# Altium schematic sheet tesis_page4_adc.SchDoc: ADC
size A4; Date: 01/04/2021; SheetNumber: 4; SheetTotal: 5
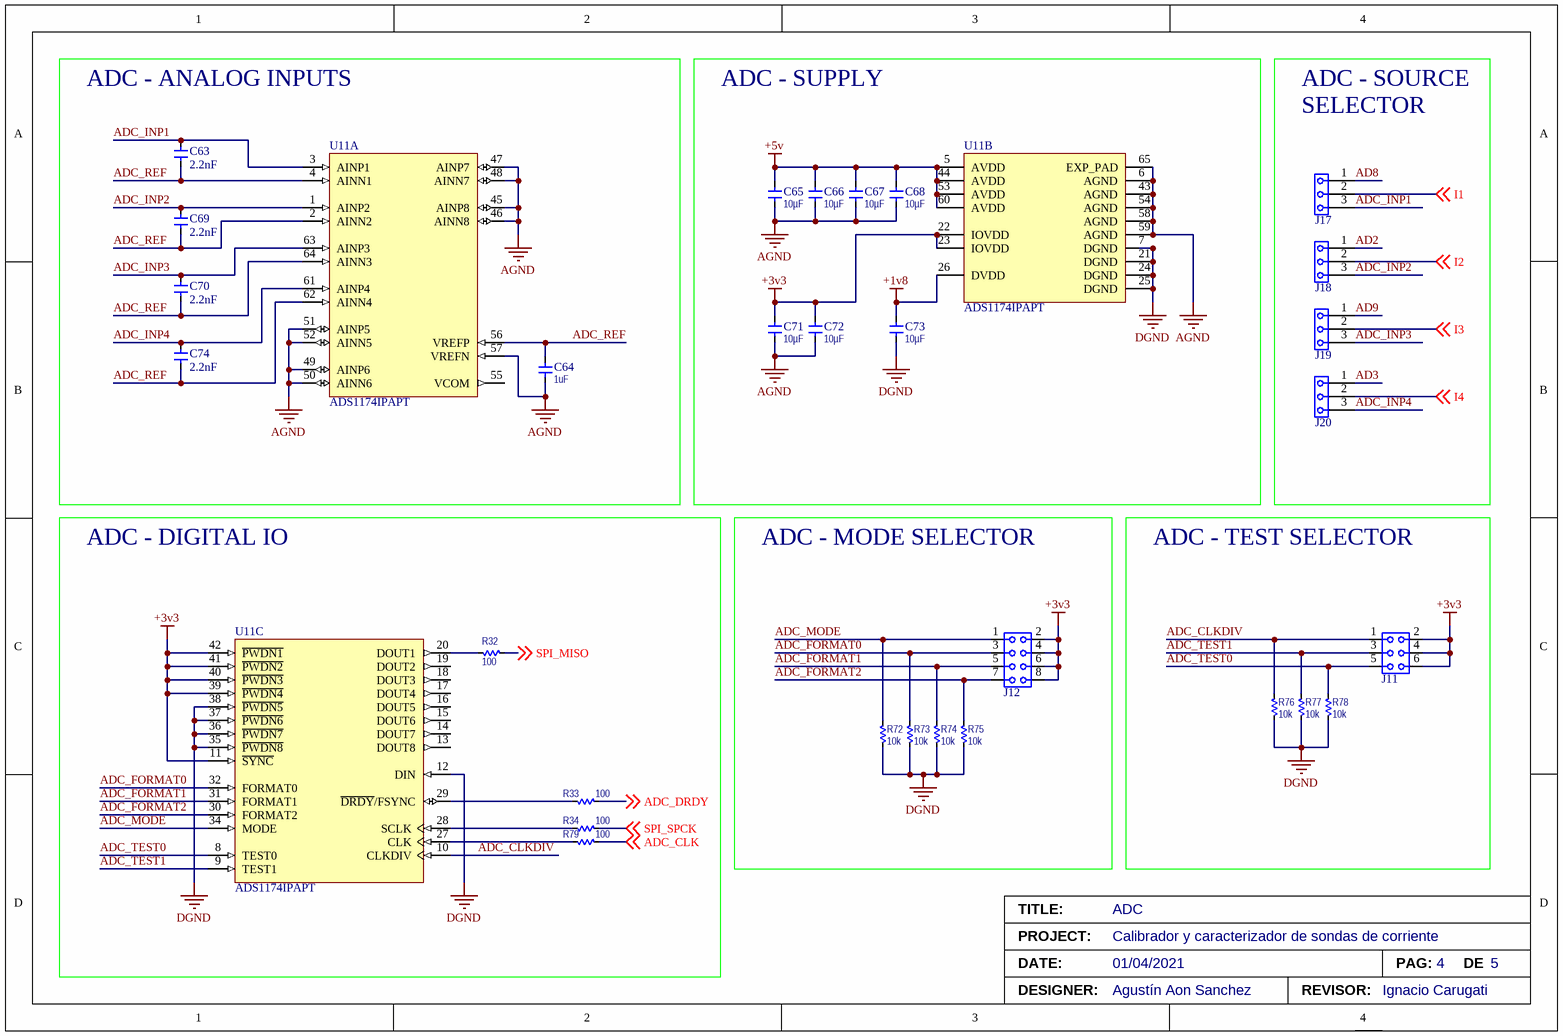
[diagram p0: tesis_page4_adc.SchDoc]

## Parts
C63  value 2.2nF  [CAPC2013X110N]  (hidden comment: CAP_C0805C222K5RACTU)
C64  value 1uF  [CAPC2013X110N]  (hidden comment: CAP_CC0805KKX7R7BB105_YAGEO)
C65  value 10µF  [CAPC2013X110N]  (hidden comment: CAP_CL21A106KOCL3RC)
C66  value 10µF  [CAPC2013X110N]  (hidden comment: CAP_CL21A106KOCL3RC)
C67  value 10µF  [CAPC2013X110N]  (hidden comment: CAP_CL21A106KOCL3RC)
C68  value 10µF  [CAPC2013X110N]  (hidden comment: CAP_CL21A106KOCL3RC)
C69  value 2.2nF  [CAPC2013X110N]  (hidden comment: CAP_C0805C222K5RACTU)
C70  value 2.2nF  [CAPC2013X110N]  (hidden comment: CAP_C0805C222K5RACTU)
C71  value 10µF  [CAPC2013X110N]  (hidden comment: CAP_CL21A106KOCL3RC)
C72  value 10µF  [CAPC2013X110N]  (hidden comment: CAP_CL21A106KOCL3RC)
C73  value 10µF  [CAPC2013X110N]  (hidden comment: CAP_CL21A106KOCL3RC)
C74  value 2.2nF  [CAPC2013X110N]  (hidden comment: CAP_C0805C222K5RACTU)
J11  CON_Header_2x3  [HDR2X3]  (value not drawn)
J12  CON_Header_2x4  [HDR2X4]  (value not drawn)
J17  CON_Header_1x3_3D  [PIN3_3Dmodel]  (value not drawn)
J18  CON_Header_1x3_3D  [PIN3_3Dmodel]  (value not drawn)
J19  CON_Header_1x3_3D  [PIN3_3Dmodel]  (value not drawn)
J20  CON_Header_1x3_3D  [PIN3_3Dmodel]  (value not drawn)
R32  value 100  [RESC2013X065BN]  (hidden comment: RES_RC0805FR-07100RL_YAGEO)
R33  value 100  [RESC2013X065BN]  (hidden comment: RES_RC0805FR-07100RL_YAGEO)
R34  value 100  [RESC2013X065BN]  (hidden comment: RES_RC0805FR-07100RL_YAGEO)
R72  value 10k  [RESC2013X065BN]  (hidden comment: RES_RC0805FR-0710KL_YAGEO)
R73  value 10k  [RESC2013X065BN]  (hidden comment: RES_RC0805FR-0710KL_YAGEO)
R74  value 10k  [RESC2013X065BN]  (hidden comment: RES_RC0805FR-0710KL_YAGEO)
R75  value 10k  [RESC2013X065BN]  (hidden comment: RES_RC0805FR-0710KL_YAGEO)
R76  value 10k  [RESC2013X065BN]  (hidden comment: RES_RC0805FR-0710KL_YAGEO)
R77  value 10k  [RESC2013X065BN]  (hidden comment: RES_RC0805FR-0710KL_YAGEO)
R78  value 10k  [RESC2013X065BN]  (hidden comment: RES_RC0805FR-0710KL_YAGEO)
R79  value 100  [RESC2013X065BN]  (hidden comment: RES_RC0805FR-07100RL_YAGEO)
U11  ADS1174IPAPT  [TFP410PAP]  (parts A,B,C of 3)

## Blocks framed on the sheet
ADC - ANALOG INPUTS: C63 C64 C69 C70 C74 U11
ADC - SUPPLY: C65-C68 C71-C73 U11
ADC - DIGITAL IO: R32-R34 R79 U11
ADC - MODE SELECTOR: J12 R72-R75
ADC - TEST SELECTOR: J11 R76-R78

## Nets
+1v8: C73.2(T2) U11.26(DVDD)
+3v3: C71.2(T2) C72.2(T2) J11.2 J11.4 J11.6 J12.2 J12.4 J12.6 J12.8 U11.11(~{SYNC}) U11.22(IOVDD) U11.23(IOVDD) U11.39(~{PWDN4}) U11.40(~{PWDN3}) U11.41(~{PWDN2}) U11.42(~{PWDN1})
+5v: C65.1(T1) C66.2(T2) C67.2(T2) C68.2(T2) U11.5(AVDD) U11.44(AVDD) U11.53(AVDD) U11.60(AVDD)
AGND: C64.2(T2) C65.2(T2) C66.1(T1) C67.1(T1) C68.1(T1) C71.1(T1) C72.1(T1) U11.6(AGND) U11.43(AGND) U11.45(AINP8) U11.46(AINN8) U11.47(AINP7) U11.48(AINN7) U11.49(AINP6) U11.50(AINN6) U11.51(AINP5) U11.52(AINN5) U11.54(AGND) U11.57(VREFN) U11.58(AGND) U11.59(AGND) U11.65(EXP_PAD)
DGND: C73.1(T1) R72.1(T1) R73.1(T1) R74.1(T1) R75.1(T1) R76.1(T1) R77.1(T1) R78.1(T1) U11.7(DGND) U11.12(DIN) U11.21(DGND) U11.24(DGND) U11.25(DGND) U11.35(~{PWDN8}) U11.36(~{PWDN7}) U11.37(~{PWDN6}) U11.38(~{PWDN5})
AD2: J18.1
AD3: J20.1
AD8: J17.1
AD9: J19.1
ADC_CLK: R79.1(T1) ; off-sheet ADC_CLK
ADC_CLKDIV: J11.1 R76.2(T2) U11.10(CLKDIV)
ADC_DRDY: R33.1(T1) ; off-sheet ADC_DRDY
ADC_FORMAT0: J12.3 R73.2(T2) U11.32(FORMAT0)
ADC_FORMAT1: J12.5 R74.2(T2) U11.31(FORMAT1)
ADC_FORMAT2: J12.7 R75.2(T2) U11.30(FORMAT2)
ADC_INP1: C63.2(T2) J17.3 U11.3(AINP1)
ADC_INP2: C69.2(T2) J18.3 U11.1(AINP2)
ADC_INP3: C70.2(T2) J19.3 U11.63(AINP3)
ADC_INP4: C74.2(T2) J20.3 U11.61(AINP4)
ADC_MODE: J12.1 R72.2(T2) U11.34(MODE)
ADC_REF: C63.1(T1) C64.1(T1) C69.1(T1) C70.1(T1) C74.1(T1) U11.2(AINN2) U11.4(AINN1) U11.56(VREFP) U11.62(AINN4) U11.64(AINN3)
ADC_TEST0: J11.5 R78.2(T2) U11.8(TEST0)
ADC_TEST1: J11.3 R77.2(T2) U11.9(TEST1)
I1: J17.2 ; off-sheet I1
I2: J18.2 ; off-sheet I2
I3: J19.2 ; off-sheet I3
I4: J20.2 ; off-sheet I4
SPI_MISO: R32.1(T1) ; off-sheet SPI_MISO
SPI_SPCK: R34.1(T1) ; off-sheet SPI_SPCK
NetR32_2: R32.2(T2) U11.20(DOUT1)
NetR33_2: R33.2(T2) U11.29(~{DRDY}/FSYNC)
NetR34_2: R34.2(T2) U11.28(SCLK)
NetR79_2: R79.2(T2) U11.27(CLK)

Not connected (* = marked no-connect by the designer): U11 13(DOUT8) 14(DOUT7) 15(DOUT6) 16(DOUT5) 17(DOUT4) 18(DOUT3) 19(DOUT2) 55(VCOM)

## Notes on the sheet
- ADC - SOURCE
- SELECTOR
- TITLE:
- PROJECT:
- DATE:
- DESIGNER:
- Calibrador y caracterizador de sondas de corriente
- 01/04/2021
- Agustín Aon Sanchez
- REVISOR:
- Ignacio Carugati
- PAG:
- DE

## Library data of the parts
C63 C69 C70 C74 = CAP_C0805C222K5RACTU: Cap Ceramic 0.0022uF 50V X7R 10% SMD 0805 125°C Paper T/R; Manufacturer: KEMET; Dissipation Factor: 2.5%; Capacitance: 2.2nF; ComponentLink1Description: https://datasheet.ciiva.com/28692/1851736-28692973.pdf?src-supplier=Element14; ComponentLink1URL: https://datasheet.ciiva.com/28692/1851736-28692973.pdf?src-supplier=Element14; ComponentLink2Description: https://datasheet.ciiva.com/28584/kem-c1002-x7r-smd-28584143.pdf?src-supplier=Element14; ComponentLink2URL: https://datasheet.ciiva.com/28584/kem-c1002-x7r-smd-28584143.pdf?src-supplier=Element14; Packaging: Tape and Reel; Series: C; Supplier 1: Digi-Key; Supplier Part Number 1: 399-1151-1-ND; Tolerance: 10%; Manufacturer Part Number: C0805C222K5RACTU; Category: Ceramic Capacitors; Mount: Surface Mount,PCB; Case/Package: 0805; Number of Pins: 2; Dielectric Material: Ceramic; Case Code (Imperial): 0805; Case Code (Metric): 2012; Min Operating Temperature: -55°C; Max Operating Temperature: 125°C; Dielectric: X7R; Voltage Rating (DC): 50V; Voltage: 50V; Package Quantity: 1; Voltage Rating: 50V; Termination: SMD/SMT; Construction: Flat; Length: 2mm; Width: 0.049inch; Height: 0.78mm; Depth: 1.25mm; Lead Pitch: 0.75mm; Thickness: 0.035inch; Radiation Hardening: No; RoHS Compliant: Yes; REACH SVHC: No SVHC
C64 = CAP_CC0805KKX7R7BB105_YAGEO: CAP CER 1UF 16V X7R 0805; Manufacturer: YAGEO; Tolerance: 10%; Supplier: *; Supplier Part No: *; Power Rating: *; BOM Populate: *; Voltage Rating: 16V; Digikey Part Number: 311-1365-1-ND; Mouser Part Number: 603-CC805KKX7R7BB105; Manufacturer Part Number: CC0805KKX7R7BB105
C65-C68 C71-C73 = CAP_CL21A106KOCL3RC: CAP CER 10UF 16V X5R 0805; Manufacturer: Samsung; Tolerance: 10%; Voltage Rating: 16V; Manufacturer Part Number: CL21A106KOCL3RC; Supplier 1: Future Electronics; RoHS: Yes; Category: Ceramic Capacitors; Stock 1: 3934; Pricing 1: 1=0,10400, 50=0,08230, 100=0,07900, 500=0,07190, 1500=0,06740 (USD); Mount: Surface Mount; Case/Package: 0805; Case Code (Metric): 2012; Case Code (Imperial): 0805; Min Operating Temperature: -55°C; Max Operating Temperature: 85°C; Package Quantity: 1; Packaging: Tape and Reel; Length: 0.079inch; Width: 0.049inch; Thickness: 0.037inch; ComponentLink1URL: https://datasheet.ciiva.com/25796/cl21a106kocl3rc-25796224.pdf?src-supplier=Digi-Key; ComponentLink1Description: https://datasheet.ciiva.com/25796/cl21a106kocl3rc-25796224.pdf?src-supplier=Digi-Key; Supplier Part Number 1: 8109145; Capacitance: 10µF
R32-R34 R79 = RES_RC0805FR-07100RL_YAGEO: RES SMD 100 OHM 1% 1/8W 0805; Manufacturer: Yageo; BOM Populate: *; Supplier Part No: *; Supplier: *; Tolerance: 1%; Digikey Part Number: 311-100CRCT-ND; Power Rating: 1/8W; Manufacturer Part Number: RC0805FR-07100RL; Mouser Part Number: 603-RC0805FR-07100RL
R72-R78 = RES_RC0805FR-0710KL_YAGEO: RES SMD 10K OHM 1% 1/8W 0805; Manufacturer: Yageo; BOM Populate: *; Supplier Part No: *; Supplier: *; Digikey Part Number: 311-10.0KCRCT-ND; Power Rating: 1/8W; Manufacturer Part Number: RC0805FR-0710KL; Mouser Part Number: 603-RC0805FR-0710KL; Tolerance: 1%
U11 = IC_ADS1174IPAPT: Quad, Simultaneous Sampling, 16-Bit Analog-to-Digital Converter 64-HTQFP -40 to 85; MF: Texas Instruments; Digi-Key_Part_Number: 296-22951-1-ND; Check_prices: https://www.snapeda.com/parts/ADS1174IPAPT/Texas%20Instruments/view-part/2772521/?ref=eda; SnapEDA_Link: https://www.snapeda.com/parts/ADS1174IPAPT/Texas%20Instruments/view-part/2772521/?ref=snap; Package: HTQFP-64 Texas Instruments; Purchase-URL: https://pricing.snapeda.com/search/part/ADS1174IPAPT/?ref=eda; MP: ADS1174IPAPT; Value: *